# Altium schematic sheet Port.SchDoc
size 127 x 177 mm; SheetNumber: 4; SheetTotal: 5
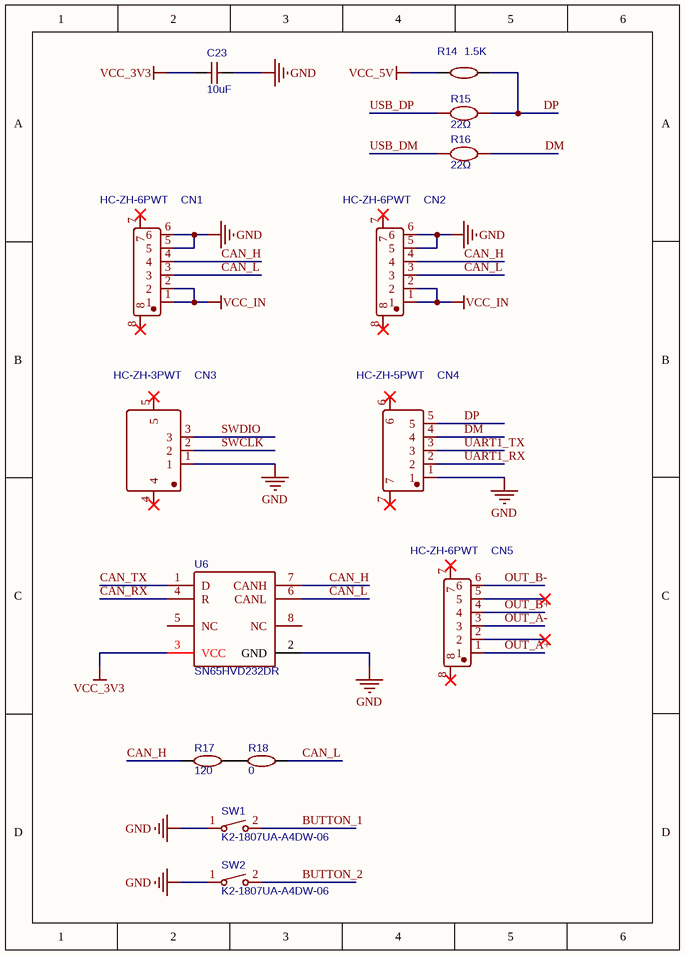
[diagram p0: Port.SchDoc]

## Parts
C23  10uF  [C1206]
CN1  HC-ZH-6PWT  [CONN-SMD_6P-P1.50_HCTL_HC-ZH-6PWT]
CN2  HC-ZH-6PWT  [CONN-SMD_6P-P1.50_HCTL_HC-ZH-6PWT]
CN3  HC-ZH-3PWT  [CONN-SMD_HC-ZH-3PWT]
CN4  HC-ZH-5PWT  [CONN-SMD_5P-P1.50_HCTL_HC-ZH-5PWT]
CN5  HC-ZH-6PWT  [CONN-SMD_6P-P1.50_HCTL_HC-ZH-6PWT]
R14  1.5K  [R0603]
R15  22Ω  [R0805]
R16  22Ω  [R0805]
R17  120  [R0603]
R18  0  [R0805]
SW1  K2-1807UA-A4DW-06  [KEY-SMD_L4.0-W2.9-L]
SW2  K2-1807UA-A4DW-06  [KEY-SMD_L4.0-W2.9-L]
U6  SN65HVD232DR  [SOIC-8_L5.0-W4.0-P1.27-LS6.0-BL]

## Nets
GND: C23.2 CN1.5 CN1.6 CN2.5 CN2.6 CN3.1 CN4.1 SW1.1 SW2.1 U6.2(GND)
VCC_3V3: C23.1 U6.3(VCC)
VCC_5V: R14.1
VCC_IN: CN1.1 CN1.2 CN2.1 CN2.2
BUTTON_1: SW1.2
BUTTON_2: SW2.2
CAN_H: CN1.4 CN2.4 R17.1 U6.7(CANH)
CAN_L: CN1.3 CN2.3 R18.2 U6.6(CANL)
CAN_RX: U6.4(R)
CAN_TX: U6.1(D)
DM: CN4.4 R16.2
DP: CN4.5 R14.2 R15.2
OUT_A+: CN5.1
OUT_A-: CN5.3
OUT_B+: CN5.4
OUT_B-: CN5.6
SWCLK: CN3.2
SWDIO: CN3.3
UART1_RX: CN4.2
UART1_TX: CN4.3
USB_DM: R16.1
USB_DP: R15.1
NetR17_2: R17.2 R18.1

Not connected (* = marked no-connect by the designer): CN1 7* 8*; CN2 7* 8*; CN3 4* 5*; CN4 6* 7*; CN5 2* 5* 7* 8*; U6 5(NC) 8(NC)

## Library data of the parts
C23 = 10uF: BOM_Manufacturer Part: CL31A106KBHNNNE; BOM_Manufacturer: SAMSUNG; nameAlias: Capacitance; BOM_Supplier: LCSC; BOM_Supplier Part: C13585; BOM_JLCPCB Part Class: Basic Part; spicePre: C; spiceSymbolName: CL31A106KBHNNNE
CN1 CN2 CN5 = HC-ZH-6PWT: BOM_Manufacturer: HCTL(华灿天禄); Contributor: LCSC; BOM_Supplier: LCSC; BOM_Supplier Part: C2845428; BOM_Manufacturer Part: HC-ZH-6PWT; spicePre: C; spiceSymbolName: HC-ZH-6PWT
CN3 = HC-ZH-3PWT: BOM_Manufacturer: HCTL(华灿天禄); Contributor: LCSC; BOM_Supplier: LCSC; BOM_Supplier Part: C2845425; BOM_Manufacturer Part: HC-ZH-3PWT; spicePre: C; spiceSymbolName: HC-ZH-3PWT
CN4 = HC-ZH-5PWT: BOM_Manufacturer: HCTL(华灿天禄); Contributor: LCSC; BOM_Supplier: LCSC; BOM_Supplier Part: C2845427; BOM_Manufacturer Part: HC-ZH-5PWT; spicePre: C; spiceSymbolName: HC-ZH-5PWT
R14 = 1.5K: BOM_Manufacturer: UniOhm; BOM_Manufacturer Part: 0603WAF1501T5E; nameAlias: Resistance (Ohms); BOM_Supplier: LCSC; BOM_Supplier Part: C22843; BOM_JLCPCB Part Class: Basic Part; spicePre: R; spiceSymbolName: 0603WAF1501T5E
R15 R16 = 22Ω: BOM_Manufacturer: PANASONIC(松下); BOM_Manufacturer Part: ERJP06F22R0V; nameAlias: Resistance; Contributor: LCSC; BOM_Supplier: LCSC; BOM_Supplier Part: C441970; BOM_JLCPCB Part Class: Extended Part; spicePre: R; spiceSymbolName: ERJP06F22R0V
R17 = 120: BOM_Manufacturer: UniOhm; BOM_Manufacturer Part: 0603WAF1200T5E; nameAlias: Resistance (Ohms); BOM_Supplier: LCSC; BOM_Supplier Part: C22787; BOM_JLCPCB Part Class: Basic Part; spicePre: R; spiceSymbolName: 0603WAF1200T5E
R18 = 0: BOM_Manufacturer: WTC; BOM_Manufacturer Part: WR08X000PTL; nameAlias: Resistance (Ohms); BOM_Supplier: LCSC; BOM_Supplier Part: C112378; BOM_JLCPCB Part Class: Extended Part; spicePre: R; spiceSymbolName: WR08X000PTL
SW1 SW2 = K2-1807UA-A4DW-06: BOM_Manufacturer: Korean Hroparts Elec; Contributor: LCSC; BOM_Supplier: LCSC; BOM_Supplier Part: C502307; BOM_Manufacturer Part: K2-1807UA-A4DW-06; BOM_JLCPCB Part Class: Extended Part; spicePre: S; spiceSymbolName: K2-1807UA-A4DW-06
U6 = SN65HVD232DR: BOM_Manufacturer: TI; BOM_Supplier: LCSC; BOM_Manufacturer Part: SN65HVD232DR; BOM_Supplier Part: C30530; BOM_JLCPCB Part Class: Extended Part; spicePre: U; spiceSymbolName: SN65HVD232DR